# Altium project MicrophoneArray.Sensors.PrjPcb
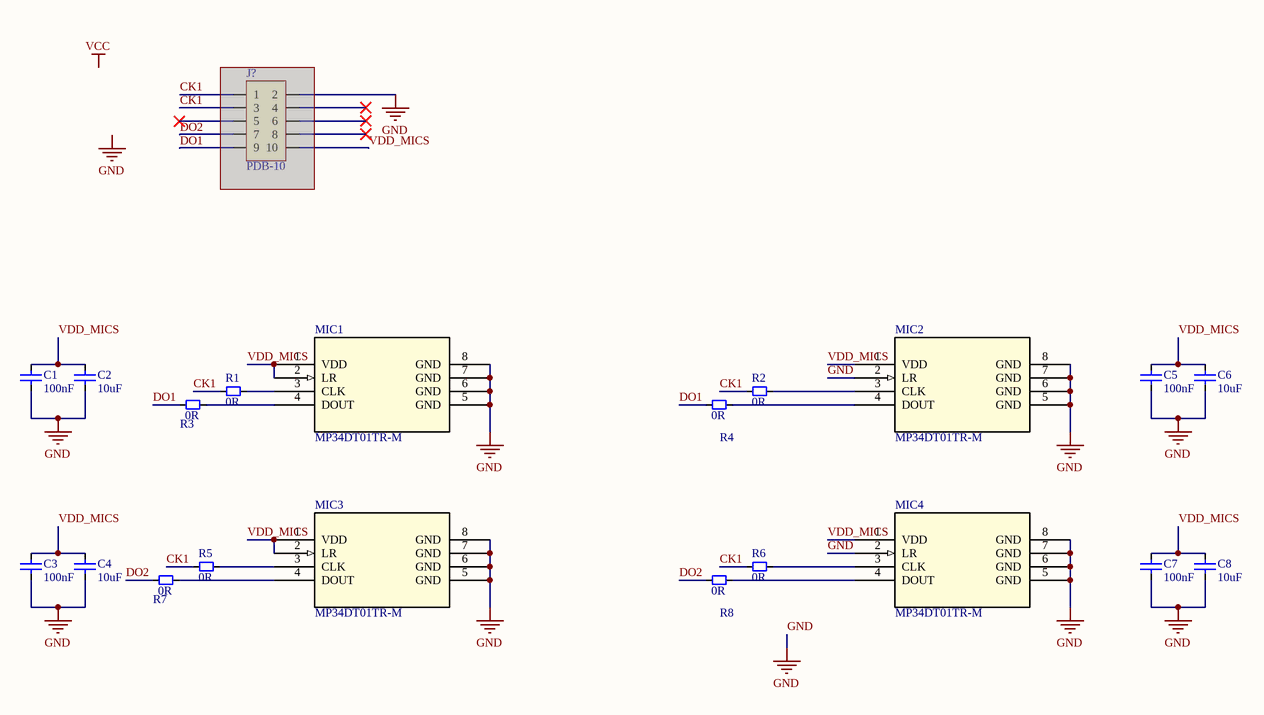
[diagram p0: MicrophoneArray.Sensors.Electronics.SchDoc]
2 sheets, 31 parts. Net scope: global (net labels, ports and power ports of the same name join across sheets).
Board file: MicrophoneArray.Sensors.WithConnector.ForPcbFactory.PcbDoc
Sheets:
  MicrophoneArray.Sensors.Electronics.SchDoc
  Connector.SchDoc

## Sheet MicrophoneArray.Sensors.Electronics.SchDoc
size A3; SheetNumber: 1; SheetTotal: 1

### Parts
C1  100nF  [CAP_0603]
C2  10uF  [CAP_0603]
C3  100nF  [CAP_0603]
C4  10uF  [CAP_0603]
C5  100nF  [CAP_0603]
C6  10uF  [CAP_0603]
C7  100nF  [CAP_0603]
C8  10uF  [CAP_0603]
J?  PDB-10  [PDB-10]  (masked out: inside a compile mask, not in the netlist)
MIC1  MP34DT01TR-M  [HCLGA_3X4X1_STM]
MIC2  MP34DT01TR-M  [HCLGA_3X4X1_STM]
MIC3  MP34DT01TR-M  [HCLGA_3X4X1_STM]
MIC4  MP34DT01TR-M  [HCLGA_3X4X1_STM]
R1  0R  [RES_0402]
R2  0R  [RES_0402]
R3  0R  [RES_0402]
R4  0R  [RES_0402]
R5  0R  [RES_0402]
R6  0R  [RES_0402]
R7  0R  [RES_0402]
R8  0R  [RES_0402]

### Nets
GND: C1.1 C2.1 C3.1 C4.1 C5.1 C6.1 C7.1 C8.1 MIC1.5(GND) MIC1.6(GND) MIC1.7(GND) MIC1.8(GND) MIC2.2(LR) MIC2.5(GND) MIC2.6(GND) MIC2.7(GND) MIC2.8(GND) MIC3.5(GND) MIC3.6(GND) MIC3.7(GND) MIC3.8(GND) MIC4.2(LR) MIC4.5(GND) MIC4.6(GND) MIC4.7(GND) MIC4.8(GND)
CK1: R1.1 R2.1 R5.1 R6.1
DO1: R3.1 R4.1
DO2: R7.1 R8.1
VDD_MICS: C1.2 C2.2 C3.2 C4.2 C5.2 C6.2 C7.2 C8.2 MIC1.1(VDD) MIC1.2(LR) MIC2.1(VDD) MIC3.1(VDD) MIC3.2(LR) MIC4.1(VDD)
NetMIC1_3: MIC1.3(CLK) R1.2
NetMIC1_4: MIC1.4(DOUT) R3.2
NetMIC2_3: MIC2.3(CLK) R2.2
NetMIC2_4: MIC2.4(DOUT) R4.2
NetMIC3_3: MIC3.3(CLK) R5.2
NetMIC3_4: MIC3.4(DOUT) R7.2
NetMIC4_3: MIC4.3(CLK) R6.2
NetMIC4_4: MIC4.4(DOUT) R8.2

### Notes on the sheet
- Labels drawn without touching a wire or pin: GND, VCC

### Library data of the parts
C1-C8 = Capacitor_Non-polar
MIC1-MIC4 = MP34DT01TR-M: Digital MEMS microphone, low power, ultra-compact, top-port, omnidirectional, 120 dBSPL AOP, 61 dB SNR, -26 dBFS sensitivity; Manufacturer_Name: STMicroelectronics; Copyright: Copyright (C) 2026 Ultra Librarian. All rights reserved.; Manufacturer_Part_Number: MP34DT01TR-M; Datasheet: https://www.st.com/resource/en/datasheet/mp34dt01-m.pdf; Digi-Key_Part_Number_1: 497-15102-2-ND; Digi-Key_Part_Number_2: 497-15102-1-ND; Digi-Key_Part_Number_3: 497-15102-6-ND; RefDes: RefDes; Type: Type
R1-R8 = Resistor

## Sheet Connector.SchDoc
size A4; SheetNumber: 2; SheetTotal: 2
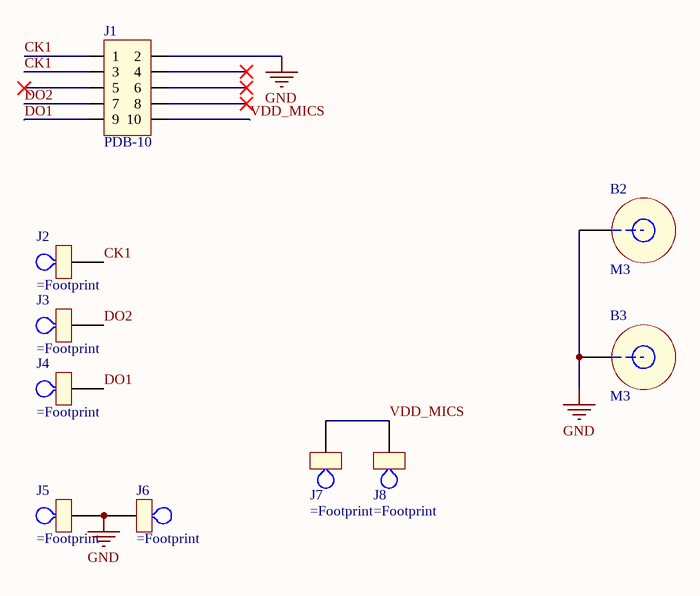
[diagram p1: Connector.SchDoc]

### Parts
B2  M3  [M3_Plated_Hole_NO_3D]  (no BOM)
B3  M3  [M3_Plated_Hole_NO_3D]  (no BOM)
J1  PDB-10  [PDB-10]
J2  (no value)  [5001]
J3  (no value)  [5001]
J4  (no value)  [5001]
J5  (no value)  [5001]
J6  (no value)  [5001]
J7  (no value)  [5001]
J8  (no value)  [5001]

### Nets
GND: B2.1 B3.1 J1.2 J5.1 J6.1
CK1: J1.1 J1.3 J2.1
DO1: J1.9 J4.1
DO2: J1.7 J3.1
VDD_MICS: J1.10 J7.1 J8.1

Not connected (* = marked no-connect by the designer): J1 4* 5* 6* 8*

### Library data of the parts
B2 B3 = M3: Machine Screw, M3
J2-J8 = Test_Point

## Nets that join several sheets
GND: MicrophoneArray.Sensors.Electronics (26 pins), Connector (5 pins)
CK1: MicrophoneArray.Sensors.Electronics (R1.1 R2.1 R5.1 R6.1), Connector (J1.1 J1.3 J2.1)
DO1: MicrophoneArray.Sensors.Electronics (R3.1 R4.1), Connector (J1.9 J4.1)
DO2: MicrophoneArray.Sensors.Electronics (R7.1 R8.1), Connector (J1.7 J3.1)
VDD_MICS: MicrophoneArray.Sensors.Electronics (14 pins), Connector (J1.10 J7.1 J8.1)